# Altium project IRLED Board.PrjPcb
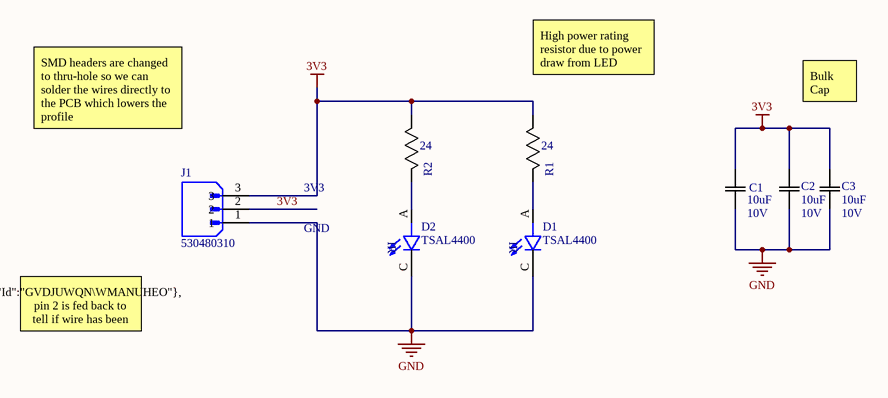
[diagram p0: IRLED Board.SchDoc]
1 sheet, 8 parts. Net scope: global (net labels, ports and power ports of the same name join across sheets).
Board file: IRLED Board.PcbDoc

## Sheet IRLED Board.SchDoc
size A; SheetNumber: 1; SheetTotal: 1

### Parts
C1  Rating: 10V  [0603]  (hidden comment: 10uF)
C2  Rating: 10V  [0603]  (hidden comment: 10uF)
C3  Rating: 10V  [0603]  (hidden comment: 10uF)
D1  TSAL4400  [IR940FOOTPRINT]
D2  TSAL4400  [IR940FOOTPRINT]
J1  530480310  [MOLEX_530480310]
R1  24  [1206]
R2  24  [1206]

### Nets
3V3: C1.2(C2) C2.2(C2) C3.2(C2) J1.2 J1.3 R1.1(R1) R2.1(R1)
GND: C1.1(C1) C2.1(C1) C3.1(C1) D1.C D2.C J1.1
NetD1_A: D1.A R1.2(R2)
NetD2_A: D2.A R2.2(R2)

### Notes on the sheet
- (near R1) High power rating resistor due to power draw from LED
- Bulk Cap
- SMD headers are changed to thru-hole so we can solder the wires directly to the PCB which lowers the profile
- 3V3
- GND
- @{"Id":"GVDJUWQN\WMANUHEO"}, pin 2 is fed back to tell if wire has been disconnected
- (in symbol TSAL4400) IR

### Library data of the parts
C1-C3 = CAP 10uF 10V: Default Symbol for Capacitors; Tolerance: 10%; Value: 10uF; Part Number: CAP 10uF 10V
D1 D2 = TSAL4400: Infrared Emitter 940nm 36mW/sr Circular Top Mount 2-Pin T-1 Bulk; MF: Vishay Semiconductor; Package: Radial Vishay; Price: None; SnapEDA_Link: https://www.snapeda.com/parts/TSAL4400/Vishay%20Semiconductor%20Opto%20Division/view-part/3623381/?ref=snap; Value: *; MP: TSAL4400; Availability: Unavailable; Part Number: TSAL4400
J1 = HDR 3POS 90deg THRU 1.25mm: Package: None; MP: 530480310; Value: *; Availability: Unavailable; Price: None; Part Number: HDR 3POS 90deg THRU 1.25mm
R1 R2 = RES 24 1W - 0.5%: Default Resistor Symbol; Manufacturer Part Number 1: HRG3216Q-24R0-D-T1; Power (Watts): 0.125W; Tolerance: 0.5%; Package: 0805; Value: 24; Part Number: RES 24 1W - 0.5%; Supplier 1: Digi-Key; Supplier Part Number 1: 408-1904-1-ND; Supplier URL 1: https://www.digikey.ca/en/products/detail/susumu/HRG3216Q-24R0-D-T1/5762559